# EAGLE design 7130mod (EAGLE 8.3.1)
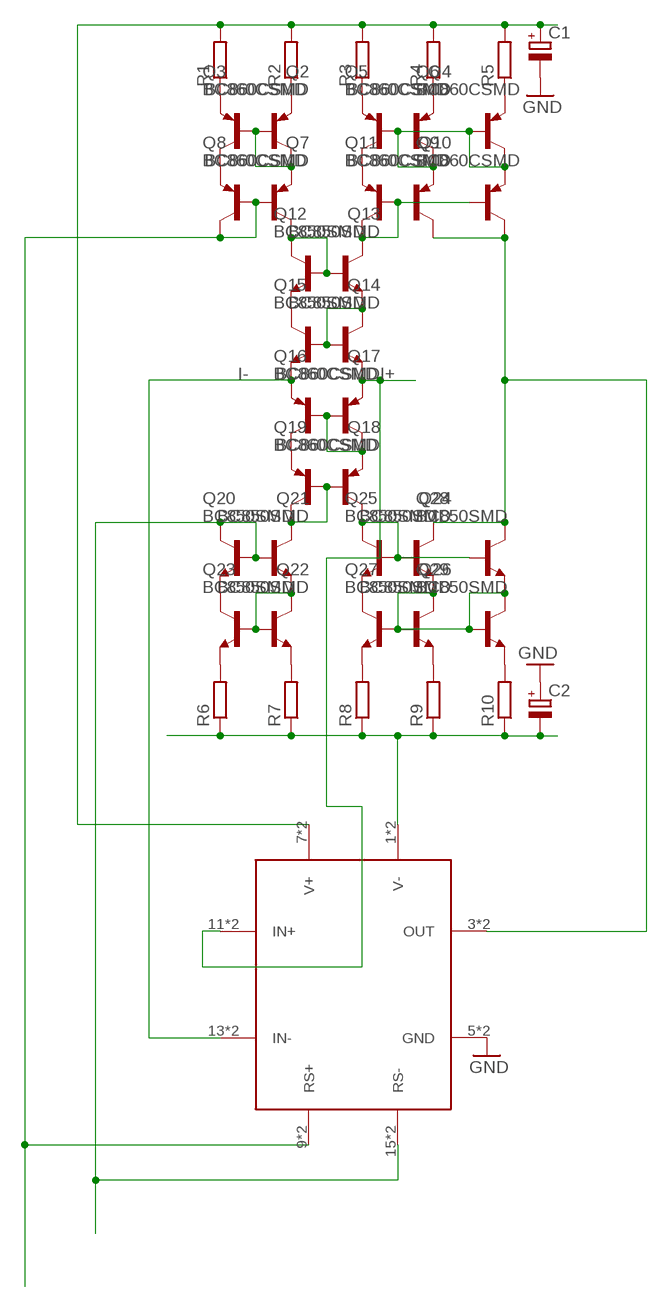
[diagram p0: schematic, sheet 1]

## Parts
C1  CPOL-EUSP-CAP-CX  [SP-CAP-CX]
C2  CPOL-EUSP-CAP-CX  [SP-CAP-CX]
Q2  BC860CSMD  [SOT23-BEC]
Q3  BC860CSMD  [SOT23-BEC]
Q4  BC860CSMD  [SOT23-BEC]
Q5  BC860CSMD  [SOT23-BEC]
Q6  BC860CSMD  [SOT23-BEC]
Q7  BC860CSMD  [SOT23-BEC]
Q8  BC860CSMD  [SOT23-BEC]
Q9  BC860CSMD  [SOT23-BEC]
Q10  BC860CSMD  [SOT23-BEC]
Q11  BC860CSMD  [SOT23-BEC]
Q12  BC850SMD  [SOT23-BEC]
Q13  BC850SMD  [SOT23-BEC]
Q14  BC850SMD  [SOT23-BEC]
Q15  BC850SMD  [SOT23-BEC]
Q16  BC860CSMD  [SOT23-BEC]
Q17  BC860CSMD  [SOT23-BEC]
Q18  BC860CSMD  [SOT23-BEC]
Q19  BC860CSMD  [SOT23-BEC]
Q20  BC850SMD  [SOT23-BEC]
Q21  BC850SMD  [SOT23-BEC]
Q22  BC850SMD  [SOT23-BEC]
Q23  BC850SMD  [SOT23-BEC]
Q24  BC850SMD  [SOT23-BEC]
Q25  BC850SMD  [SOT23-BEC]
Q26  BC850SMD  [SOT23-BEC]
Q27  BC850SMD  [SOT23-BEC]
Q28  BC850SMD  [SOT23-BEC]
Q29  BC850SMD  [SOT23-BEC]
R1  R-EU_R0805  [R0805]
R2  R-EU_R0805  [R0805]
R3  R-EU_R0805  [R0805]
R4  R-EU_R0805  [R0805]
R5  R-EU_R0805  [R0805]
R6  R-EU_R0805  [R0805]
R7  R-EU_R0805  [R0805]
R8  R-EU_R0805  [R0805]
R9  R-EU_R0805  [R0805]
R10  R-EU_R0805  [R0805]
U$1  7130MOD  [7130MOD]

## Nets
GND: C1.- C2.+ U$1.5(GND) U$1.6(GND)
I+: Q15.E Q16.E U$1.11(IN+) U$1.12(IN+)
I-: Q14.E Q17.E U$1.13(IN-) U$1.14(IN-)
N$1: Q2.E R1.1
N$2: Q2.B Q3.B Q3.C Q8.E
N$3: Q3.E R2.1
N$4: Q2.C Q7.E
N$5: Q7.B Q7.C Q8.B U$1.9(RS+) U$1.10(RS+)
N$6: Q4.E R3.1
N$7: Q4.B Q5.B Q5.C Q6.B Q6.C Q9.E Q11.E
N$8: Q5.E R4.1
N$9: Q6.E R5.1
N$10: Q8.C Q12.B Q13.B Q13.C
N$11: Q9.C Q11.C Q25.C Q28.C U$1.3(OUT) U$1.4(OUT)
N$12: Q4.C Q10.E
N$13: Q12.E Q14.B Q15.B Q15.C
N$14: Q9.B Q10.B Q10.C Q11.B Q12.C
N$16: Q13.E Q14.C
N$20: Q16.B Q16.C Q17.B Q19.E
N$21: Q17.C Q18.E
N$23: Q18.B Q18.C Q19.B Q20.C
N$25: Q20.B Q21.B Q21.C U$1.15(RS-) U$1.16(RS-)
N$26: Q21.E Q22.C
N$27: Q20.E Q22.B Q23.B Q23.C
N$29: Q19.C Q24.B Q24.C Q25.B Q28.B
N$31: Q24.E Q26.C
N$32: Q25.E Q26.B Q27.B Q27.C Q28.E Q29.B Q29.C
N$36: Q22.E R6.2
N$37: Q23.E R7.2
N$38: Q26.E R8.2
N$39: Q27.E R9.2
N$40: Q29.E R10.2
V+: C1.+ R1.2 R2.2 R3.2 R4.2 R5.2 U$1.7(V+) U$1.8(V+)
V-: C2.- R6.1 R7.1 R8.1 R9.1 R10.1 U$1.1(V-) U$1.2(V-)

## Library data of the parts
C1 C2 = Vwvwbg:CPOL-EU: POLARIZED CAPACITOR, European symbol
Q2-Q11 Q16-Q19 = tranzistory SMD PNP:BC860*: PNP Transistror
Q12-Q15 Q20-Q29 = tranzistory SMD NPN:BC850*: NPN Transistor
R1-R10 = Vwvwbg:R-EU_: RESISTOR, European symbol
U$1 = Vwvwbg:7130MOD

## Board
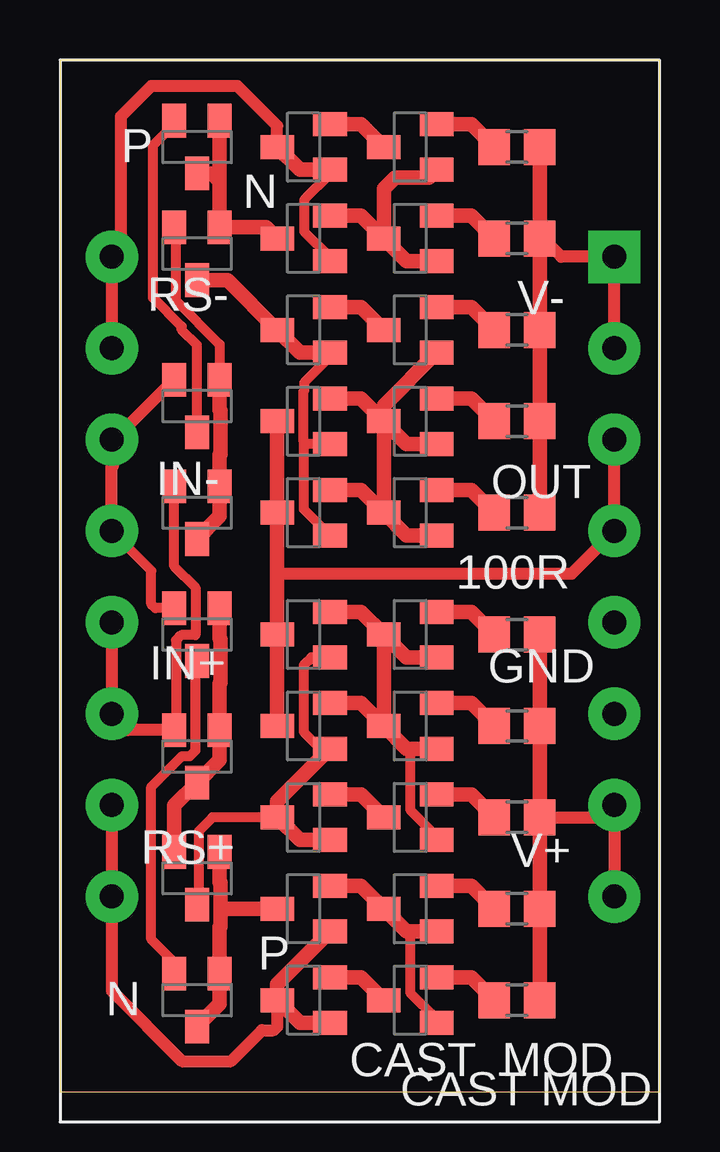
[diagram p1: board, top side]
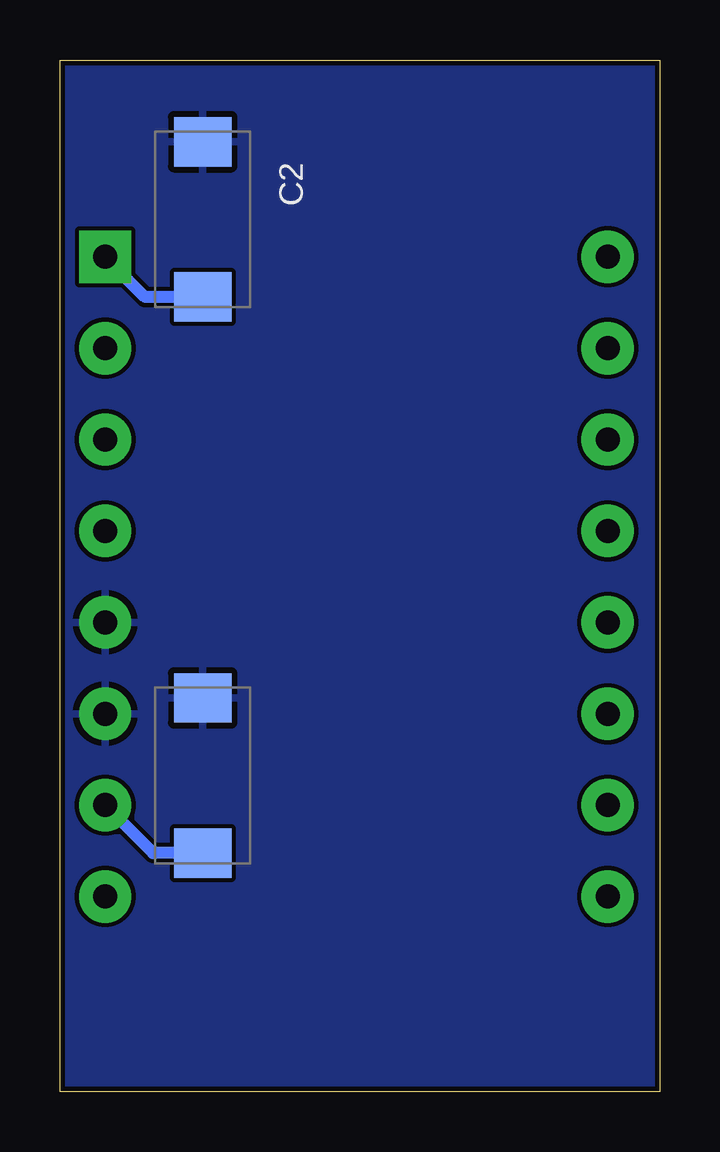
[diagram p2: board, bottom side, seen from below]

Size 25 x 43 mm. Coordinates in mm from the lower left corner, seen from the top.
Outline: 0,0 25,0 25,43 0,43 0,0
Copper layers (1*16): Top 0.035mm / dielectric 1.5mm / Bottom 0.035mm
Design rules "default": minimum track width 6mil, minimum drill 0.3mm, track to track 7mil, track to pad 7mil, pad to pad 7mil, via to via 7mil, smd to smd 7mil, copper to edge 8mil, drill to drill 8mil, minimum pad ring 6mil, minimum via ring 6mil, stop-mask expansion 4mil, vias tented up to drill 0mil, thermal gap 10mil

### Footprints (pad centres in the part's own frame; a part is rotated, then mirrored left to right if it is on the bottom)
SP-CAP-CX = smd 2.062 x 2.4: + -2.754,0; - 3.707,0
SOT23-BEC = smd 1 x 1.4: B -0.95,-1.1; C 0,1.1; E 0.95,-1.1
R0805 = smd 1.3 x 1.5: 1 -0.95,0; 2 0.95,0
7130MOD = drill 1 pad 2.184 square: 1 23.114,34.798 | drill 1 pad 2.184: 2 23.114,30.988; 3 23.114,27.178; 4 23.114,23.368; 5 23.114,19.558; 6 23.114,15.748; 7 23.114,11.938; 8 23.114,8.128; 9 2.159,8.128; 10 2.159,11.938; 11 2.159,15.748; 12 2.159,19.558; 13 2.159,23.368; 14 2.159,27.178; 15 2.159,30.988; 16 2.159,34.798

### Placement (x,y rotation side)
C1  19.05,12.7 90 bottom
C2  19.05,36.83 270 bottom
Q2  14.61,3.81 90 top
Q3  14.61,7.62 90 top
Q4  14.61,11.43 90 top
Q5  14.61,15.24 90 top
Q6  14.61,19.05 90 top
Q7  10.16,3.81 90 top
Q8  10.16,7.62 90 top
Q9  10.16,19.05 90 top
Q10  10.16,11.43 90 top
Q11  10.16,15.24 90 top
Q12  5.71,8.89 180 top
Q13  5.71,3.81 180 top
Q14  5.71,19.05 180 top
Q15  5.71,13.97 180 top
Q16  5.71,24.13 180 top
Q17  5.71,28.57 180 top
Q18  5.71,39.37 180 top
Q19  5.71,34.92 180 top
Q20  10.16,35.56 90 top
Q21  10.16,39.37 90 top
Q22  14.61,39.37 90 top
Q23  14.61,35.56 90 top
Q24  10.16,31.75 90 top
Q25  10.16,27.94 90 top
Q26  14.61,31.75 90 top
Q27  14.61,27.94 90 top
Q28  10.16,24.13 90 top
Q29  14.61,24.13 90 top
R1  19.05,3.81 0 top
R2  19.05,7.62 0 top
R3  19.05,11.43 0 top
R4  19.05,15.24 0 top
R5  19.05,19.05 0 top
R6  19.05,39.37 180 top
R7  19.05,35.56 180 top
R8  19.05,31.75 180 top
R9  19.05,27.94 180 top
R10  19.05,24.13 180 top
U$1  0,0 0 top

### Tracks (layer width: path | path; a pad name or v marks a point on that pad's centre or on a via)
GND
  pour Bottom: -5.08,46.99 27.94,46.99 27.94,-3.81 -5.08,-3.81
I+
  Top 0.406: Q16.E 4.76,21.89 5.65,21.01 5.65,19.03 5.06,19.03 4.83,18.81 4.83,15.14 Q15.E
  Top 0.508: Q15.E 2.84,15.07 U$1.11 U$1.12
I-
  Top 0.406: Q14.E 3.98,20.15 3.81,20.32 3.81,21.72 U$1.13
  Top 0.508: 2.16,26.04 U$1.14 2.27,27.18 Q17.E | U$1.13 2.16,26.04 | 2.21,26.09 2.16,26.04
N$1
  Top 0.61: Q2.E 17.15,4.76 R1.1
N$2
  Top 0.406: Q2.B 15.71,3.02 14.62,4.1 14.62,6.5 14.46,6.67
  Top 0.61: Q8.E 12.55,8.57 Q3.C 14.46,6.67 Q3.B
N$3
  Top 0.61: Q3.E 17.15,8.57 R2.1
N$4
  Top 0.61: Q7.E 12.55,4.76 Q2.C
N$5
  Top 0.406: 2.16,8.22 U$1.9
  Top 0.508: Q7.C 9.06,2.71 8.91,2.56 8.42,2.56 7.13,1.27 5.08,1.27 2.16,4.19 U$1.9 | U$1.10 2.16,8.22
  Top 0.61: Q7.B 10.01,2.86 Q7.C 9.06,4.47 Q8.B
N$6
  Top 0.61: Q4.E 17.15,12.38 R3.1
N$7
  Top 0.406: Q4.B 15.71,10.64 14.62,11.72 14.62,14.12 14.46,14.29
  Top 0.61: Q6.B 14.46,18.1 Q6.C | Q9.E 12.55,20 Q6.C | Q5.B 14.46,14.29 Q5.C | Q11.E 12.55,16.19 Q5.C | Q5.C Q6.C
N$8
  Top 0.61: Q5.E 17.15,16.19 R4.1
N$9
  Top 0.61: Q6.E 17.15,20 R5.1
N$10
  Top 0.61: Q13.C 6.67,3.66 Q13.B 6.67,6.86 6.7,6.89 6.7,7.49 | Q12.B 6.67,8.72 6.7,8.69 6.7,7.49 | Q8.C 6.83,7.62 6.7,7.49
N$11
  Top 0.508: U$1.3 U$1.4 21.34,21.59 9.06,21.59
  Top 0.61: Q11.C Q9.C 9.06,21.59 Q28.C Q25.C
N$12
  Top 0.61: Q10.E 12.55,12.38 Q4.C
N$13
  Top 0.61: Q12.E 4.76,11.92 Q15.C 6.67,13.82 Q15.B 6.67,17.02 6.7,17.05 6.7,18.85 6.67,18.88 Q14.B
N$14
  Top 0.406: Q9.B 10.48,18.1 10.16,17.78 10.16,14.99 11.06,14.09 | Q10.C 6.35,11.43 6.35,11.41 5.78,10.85 5.78,7.86 Q12.C
  Top 0.61: Q10.B 10.01,10.48 Q10.C 9.06,12.09 11.06,14.09 Q11.B
N$16
  Top 0.406: Q13.E 4.76,5.39 3.81,6.35 3.81,12.7 5.06,13.95 5.1,13.99 5.42,13.99 5.65,14.21 5.65,17.88 Q14.C
N$20
  Top 0.406: Q19.E 4.83,35.96 4.83,32.97 6.67,31.14 Q17.B
  Top 0.61: Q17.B 6.67,28.41 6.7,28.38 6.7,26.57 6.67,26.54 Q16.B 6.67,23.98 Q16.C
N$21
  Top 0.406: Q17.C 5.71,31.11 5.08,31.75 5.08,31.89 3.88,33.09 3.88,39.45 4.76,40.33 Q18.E
N$23
  Top 0.61: Q20.C 8.6,36.02 Q19.B 6.67,37.94 | 6.67,37.94 Q18.B | Q18.C 6.33,38.27 6.67,37.94
N$25
  Top 0.406: Q21.B 11.26,38.25 10.18,37.17 10.18,35.85 11.26,34.77 Q20.B
  Top 0.508: U$1.15 U$1.16 2.54,35.18 2.54,40.64 3.81,41.91 7.4,41.91 9.06,40.25 Q21.C
  Top 0.61: Q21.B 10.01,38.42 Q21.C
N$26
  Top 0.61: Q21.E 12.55,40.32 Q22.C
N$27
  Top 0.61: Q23.B 14.46,34.61 Q23.C | Q20.E 12.55,36.51 Q23.C | Q23.C 13.51,37.63 13.97,38.1 15.38,38.1 Q22.B
N$29
  Top 0.406: Q24.B 11.26,30.63 10.18,29.55 10.18,29.23 10.16,29.21 10.16,27.1 | 10.16,27.1 10.16,24.28 Q28.B | Q25.B 10.27,26.99 10.16,27.1
  Top 0.61: Q24.B 10.01,30.8 Q24.C 6.99,33.83 Q19.C
N$31
  Top 0.61: Q24.E 12.55,32.7 Q26.C
N$32
  Top 0.61: Q29.B 14.46,23.18 Q29.C | Q28.E 12.55,25.08 Q29.C | Q27.B 14.46,26.99 Q27.C | Q25.E 12.55,28.89 Q27.C | Q27.C Q29.C | Q27.C 13.51,28.6 Q26.B
N$36
  Top 0.61: Q22.E 17.15,40.32 R6.2
N$37
  Top 0.61: Q23.E 17.15,36.51 R7.2
N$38
  Top 0.61: Q26.E 17.15,32.7 R8.2
N$39
  Top 0.61: Q27.E 17.15,28.89 R9.2
N$40
  Top 0.61: Q29.E 17.15,25.08 R10.2
V+
  Top 0.508: U$1.8 U$1.7 22.61,11.43 R3.2
  Top 0.61: R5.2 R4.2 R3.2 R2.2 R1.2
  Bottom 0.508: C1.+ 21.12,9.95 U$1.7
V-
  Top 0.508: U$1.2 U$1.1 20.9,34.8 20,35.7
  Top 0.61: R6.1 20,35.7 R7.1 R8.1 R9.1 R10.1
  Bottom 0.508: C2.- 21.44,33.12 U$1.1

### Text on the board
tNames: P | N | 100R | P | N | CAST | MOD